# EAGLE schematic Lab5Prep (EAGLE 9.0.1)
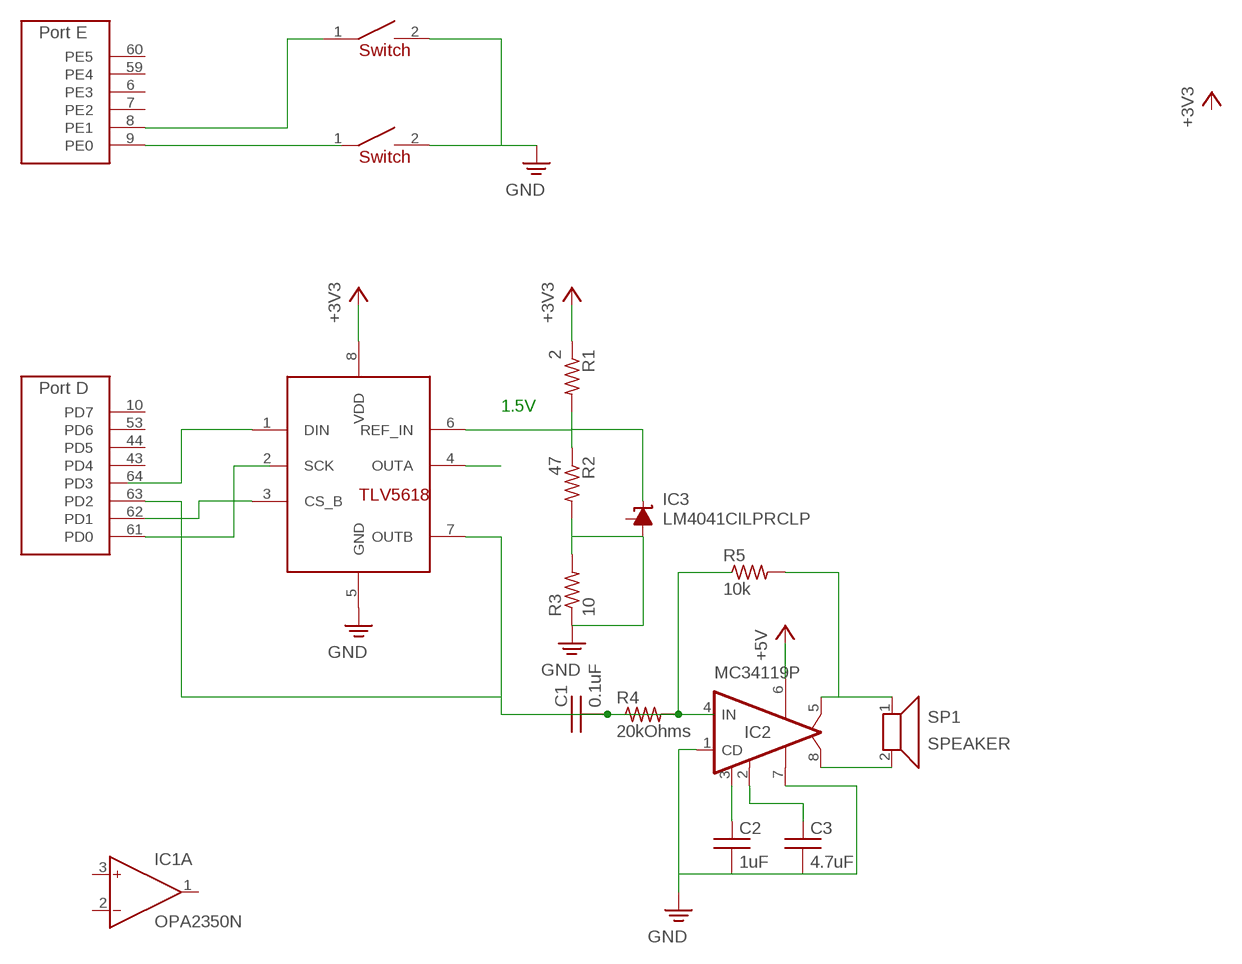
[diagram p0: schematic, sheet 1]

## Parts
C1  0.1uF  CAPACITOR025-024X044  [CAP100MIL]
C2  1uF  CAPACITOR025-024X044  [CAP100MIL]
C3  4.7uF  CAPACITOR025-024X044  [CAP100MIL]
IC1  OPA2350N  [DIL08]
IC2  MC34119P  [DIL08]
IC3  LM4041CILPRCLP  [LP_O-PBCY-W3]
R1  2  RESISTOR0204/7  [RES300MIL]
R2  47  RESISTOR0204/7  [RES300MIL]
R3  10  RESISTOR0204/7  [RES300MIL]
R4  20kOhms  RESISTOR0204/5  [RES200MIL]
R5  10k  RESISTOR0204/5  [RES200MIL]
SP1  SPEAKER  [1X02]
U$1  TM4C123GH6PM  [QFP50P1200X1200X160-64N]
U$2  TLV5618  [DIL08]
U$4  SW_POWER_100MIL  [SW_POWER]
U$5  SW_POWER_100MIL  [SW_POWER]

## Nets
+3V3: R1.1 U$2.8(VDD)
+5V: IC2.6(VCC)
GND: C2.2 C3.2 IC2.1(CD) IC2.7(GND) IC3.3(A) R2.2 R3.1 R3.2 U$2.5(GND) U$4.2 U$5.2
N$1: IC3.2(C) R1.2 R2.1 U$2.6(REF_IN)
N$2: C1.1 C1.2 R4.1 R4.2 U$1.63(PD2) U$2.7(OUTB)
N$3: U$2.4(OUTA)
N$5: U$1.61(PD0)
N$6: U$2.1(DIN)
N$7: IC2.5(VO1) R5.2 SP1.1
N$8: IC2.8(VO2) SP1.2
N$9: C2.1 IC2.3(FC1)
N$10: C3.1 IC2.2(FC2)
N$11: U$1.62(PD1) U$2.3(CS_B)
N$12: U$1.9(PE0)
N$13: U$1.8(PE1) U$4.1
Unconnected: IC1.1(A:OUT) IC1.2(A:IN-) IC1.3(A:IN+) IC1.5(B:IN+) IC1.6(B:IN-) IC1.7(B:OUT) IC2.4(IN) IC3.1(FB) R5.1 U$1.1(PB6) U$1.2(VDDA) U$1.3(GNDA) U$1.4(PB7) U$1.5(PF4) U$1.6(PE3) U$1.7(PE2) U$1.10(PD7) U$1.11(VDD_1) U$1.12(GND_1) U$1.13(PC7) U$1.14(PC6) U$1.15(PC5) U$1.16(PC4) U$1.17(PA0) U$1.18(PA1) U$1.19(PA2) U$1.20(PA3) U$1.21(PA4) U$1.22(PA5) U$1.23(PA6) U$1.24(PA7) U$1.25(VDDC_1) U$1.26(VDD_2) U$1.27(GND_2) U$1.28(PF0) U$1.29(PF1) U$1.30(PF2) U$1.31(PF3) U$1.32(!WAKE) U$1.33(!HIB) U$1.34(XOSC0) U$1.35(GNDX) U$1.36(XOSC1) U$1.37(VBAT) U$1.38(!RST) U$1.39(GND_3) U$1.40(OSC0) U$1.41(OSC1) U$1.42(VDD_3) U$1.43(PD4) U$1.44(PD5) U$1.45(PB0) U$1.46(PB1) U$1.47(PB2) U$1.48(PB3) U$1.49(PC3) U$1.50(PC2) U$1.51(PC1) U$1.52(PC0) U$1.53(PD6) U$1.54(VDD_4) U$1.55(GND_4) U$1.56(VDDC_2) U$1.57(PB5) U$1.58(PB4) U$1.59(PE4) U$1.60(PE5) U$1.64(PD3) U$2.2(SCK) U$5.1

## Notes on the sheet
- 1.5V

## Power pins joined to a net without a drawn wire
V+: IC1.8(P:V+)
V-: IC1.4(P:V-)

## Library data of the parts
C1-C3 = EE445L:CAPACITOR: CAPACITOR, American symbol
IC1 = EE445L:OPA2350: 2.7V to 5.5V Rail-to-Rail I/O Dual Amplifier High-Speed 38MHz, Single-Supply, slew rate 22V/us, 500uV offset, 4uV noise; OC_FARNELL: unknown; OC_NEWARK: unknown
IC2 = EE445L:MC34119: Low Power Audio Amplifier Motorola
IC3 = EE445L:LM4041CILPR: PRECISION MICROPOWER SHUNT VOLTAGE REFERENCE Adjustable Output Source: http://focus.ti.com/lit/ds/slcs146e/slcs146e.pdf LM4041CILPR Let R1 be the resistor from Vref to +3.3V Let R2 be the resistor from Vref to FB Let R3 be the resistor from FB to ground Vref = 1.23*(1+R3/R2) Iref=(3.3V-Vref)/R1 - 100uA; MPN: LM4041CILP; OC_FARNELL: 1673945; OC_NEWARK: 50M8856
R1-R5 = EE445L:RESISTOR: RESISTOR, American symbol
SP1 = EE445L:SPEAKER: Speaker Connected off PCB with two wires. 32-ohm speaker, AllElectronics, SK-230, http://www.allelectronics.com/make-a-store/item/sk-230/20-mm-32-ohm-speaker/1.html
U$1 = EE445L:TM4C123GH6PM
U$2 = EE445L:TLV5618: The TLV5618A is a dual 12-bit voltage output DAC with a flexible 3-wire serial interface. The serial interface is compatible with TMS320, SPI, QSPI, and Microwire serial ports. It is programmed with a 16-bit serial string containing 4 control and 12 data bits
U$4 U$5 = EE445L:SW_POWER_100MIL